# EAGLE design Raven_Programmer (EAGLE 9.6.2)
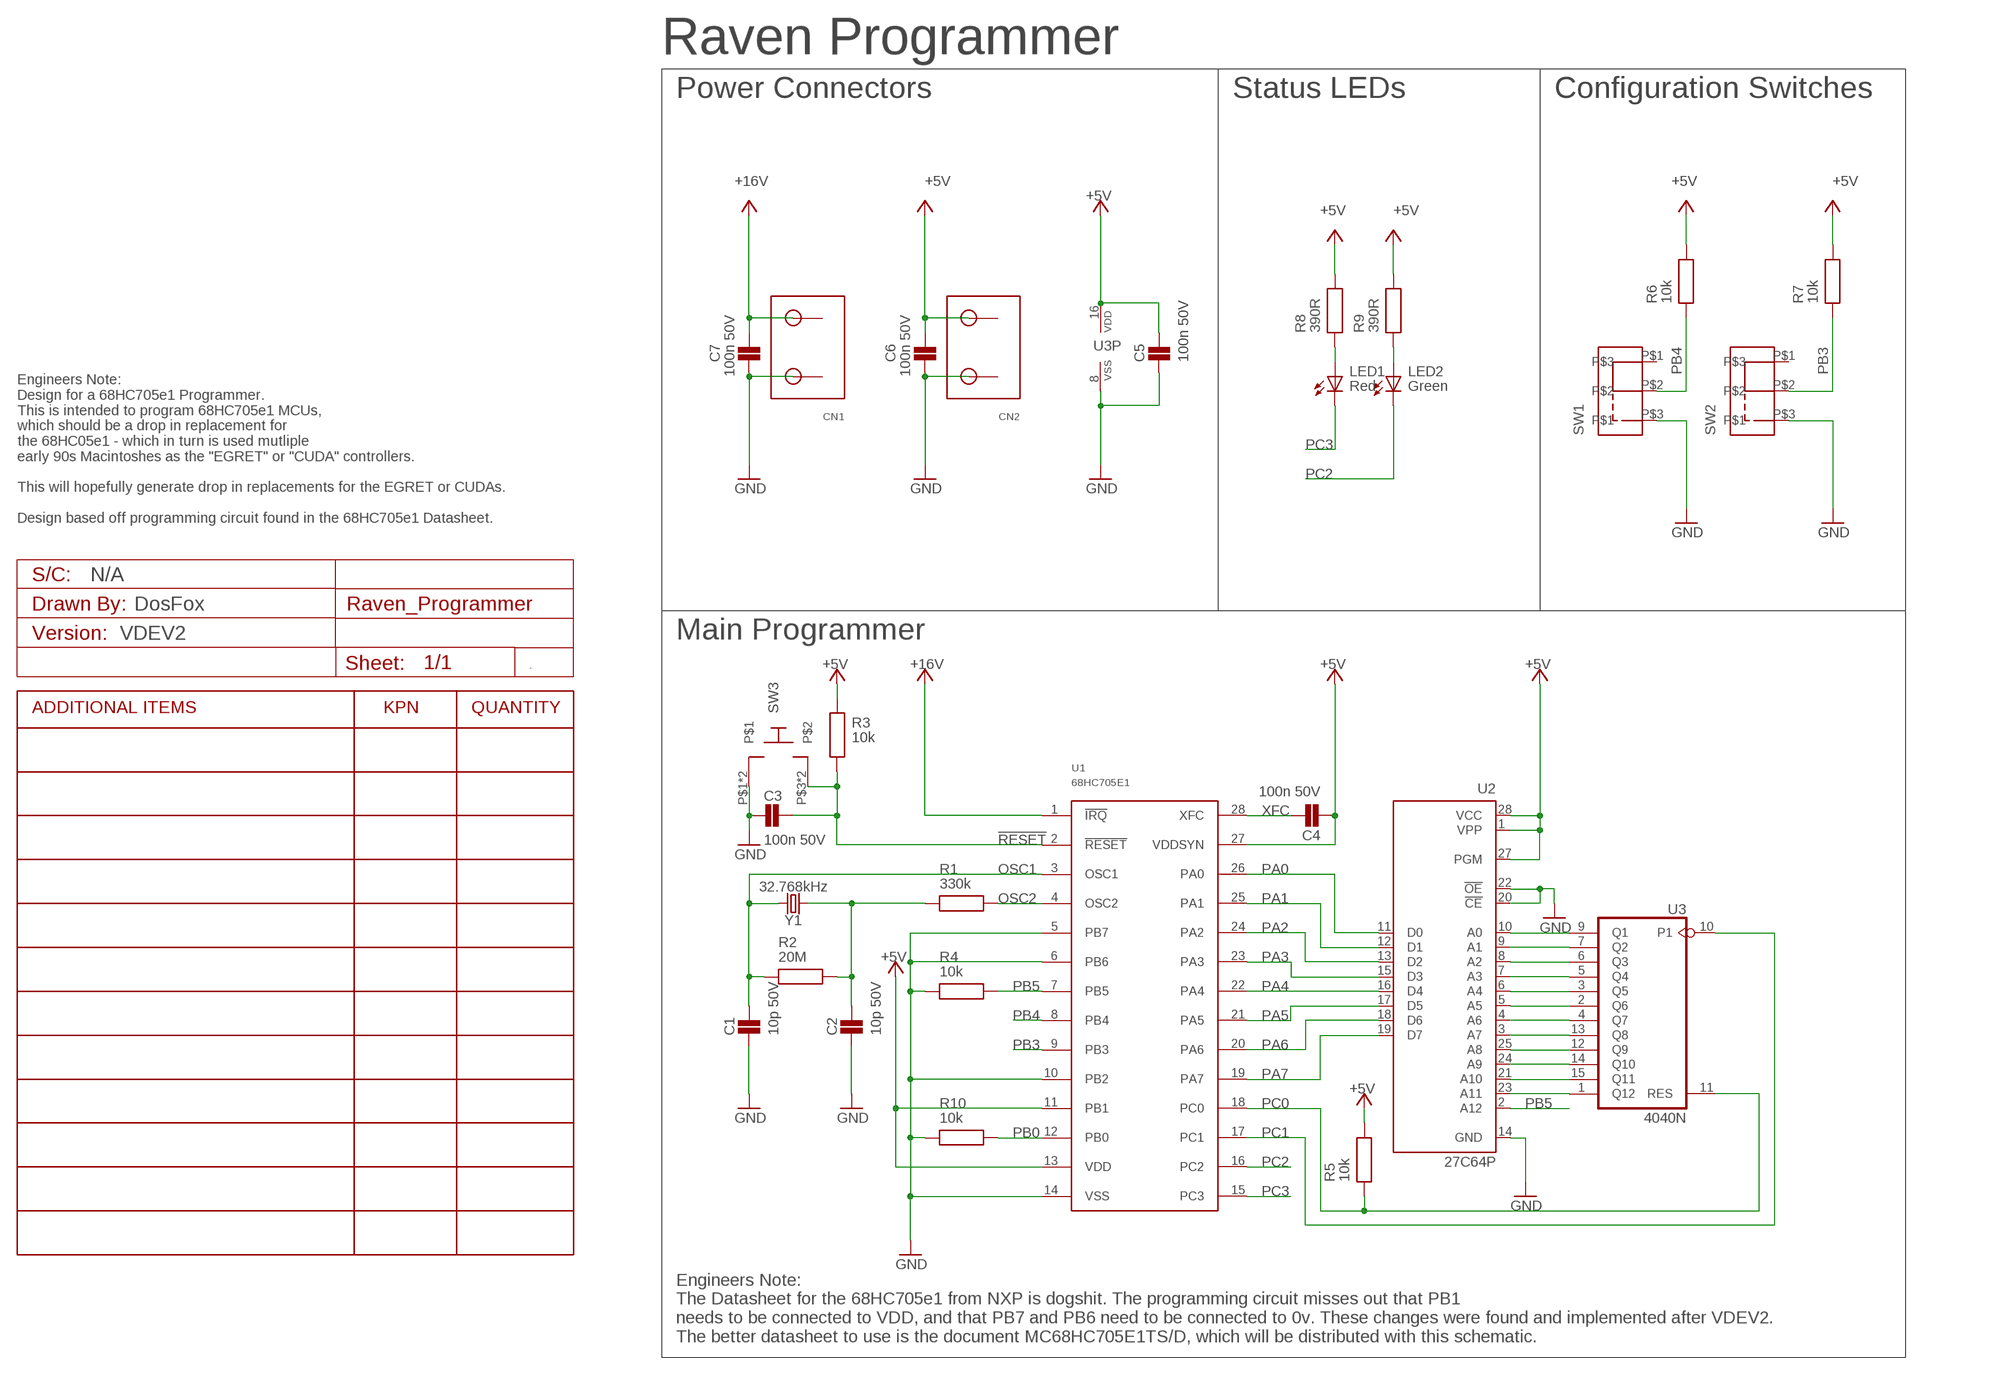
[diagram p0: schematic, sheet 1]

## Parts
A1  VDEV2  PROJECT_DETAILS_CUSTOM  [PCB_CUSTOM_DETAILS]
C1  10p 50V  1N_TH_CAP  [CAP_5.08MM_PITCH]
C2  10p 50V  1N_TH_CAP  [CAP_5.08MM_PITCH]
C3  100n 50V  100N_TH_CAP  [CAP_5.08MM_PITCH]
C4  100n 50V  100N_TH_CAP  [CAP_5.08MM_PITCH]
C5  100n 50V  100N_TH_CAP  [CAP_5.08MM_PITCH]
C6  100n 50V  100N_TH_CAP  [CAP_5.08MM_PITCH]
C7  100n 50V  100N_TH_CAP  [CAP_5.08MM_PITCH]
CN1  VTB301V-2P-B  TERMINALBLOCK2WAY  [TERMINALBLOCK2WAY]
CN2  VTB301V-2P-B  TERMINALBLOCK2WAY  [TERMINALBLOCK2WAY]
LED1  Red  5MM_LED_RED  [5MM_TH_VERT_STANDARD]
LED2  Green  5MM_LED_GREEN  [5MM_TH_VERT_STANDARD]
R1  330k  330K_TH_RESISTOR  [RESISTORTHRUHOLE]
R2  20M  10M_TH_RESISTOR  [RESISTORTHRUHOLE]
R3  10k  10K_TH_RESISTOR  [RESISTORTHRUHOLE]
R4  10k  10K_TH_RESISTOR  [RESISTORTHRUHOLE]
R5  10k  10K_TH_RESISTOR  [RESISTORTHRUHOLE]
R6  10k  10K_TH_RESISTOR  [RESISTORTHRUHOLE]
R7  10k  10K_TH_RESISTOR  [RESISTORTHRUHOLE]
R8  390R  330R_TH_RESISTOR  [RESISTORTHRUHOLE]
R9  390R  330R_TH_RESISTOR  [RESISTORTHRUHOLE]
R10  10k  10K_TH_RESISTOR  [RESISTORTHRUHOLE]
SW1  SK12D07_SLIDE_SWITCH  [SK12D07_SLIDE_SWITCH]
SW2  SK12D07_SLIDE_SWITCH  [SK12D07_SLIDE_SWITCH]
SW3  DTS-61  DIP_TACT_SWITCH_6X6TH  [DIP_DTS_6_TACT_SWITCH_6X6_TH]
U1  68HC705E1  [DIP28]
U2  27C64P  [DIL28-6]
U3  4040N  [DIL16]
Y1  32.768kHz  CRYSTAL-32.768KHZPTH-2X6  [CRYSTAL-PTH-2X6-CYL]

## Nets
!RESET: C3.P$2 R3.P$1 SW3.P$3 SW3.P$4 U1.2(!RESET)
+5V: C4.P$1 C5.P$2 C6.P$2 CN2.P$2 R3.P$2 R5.P$2 R6.P$2 R7.P$2 R8.P$2 R9.P$2 U1.11(PB1) U1.13(VDD) U1.27(VDDSYN) U2.1(VPP) U2.27(PGM) U2.28(VCC) U3.16(VDD) ; supply symbol labelled VBUS
+16V: C7.P$2 CN1.P$2 U1.1(!IRQ) ; supply symbol labelled VBUS
GND: C1.P$1 C2.P$1 C3.P$1 C5.P$1 C6.P$1 C7.P$1 CN1.P$1 CN2.P$1 R4.P$1 R10.P$1 SW1.P$3 SW2.P$3 SW3.P$1 SW3.P$2 U1.5(PB7) U1.6(PB6) U1.10(PB2) U1.14(VSS) U2.14(GND) U2.20(!CE) U2.22(!OE) U3.8(VSS)
N$1: U2.10(A0) U3.9(Q1)
N$2: U2.9(A1) U3.7(Q2)
N$3: U2.8(A2) U3.6(Q3)
N$4: U2.7(A3) U3.5(Q4)
N$5: U2.6(A4) U3.3(Q5)
N$6: U2.4(A6) U3.4(Q7)
N$7: U2.5(A5) U3.2(Q6)
N$8: U2.3(A7) U3.13(Q8)
N$9: U2.25(A8) U3.12(Q9)
N$10: U2.24(A9) U3.14(Q10)
N$11: U2.21(A10) U3.15(Q11)
N$12: U2.23(A11) U3.1(Q12)
N$30: C2.P$2 R1.P$1 R2.P$2 Y1.1
N$36: LED1.A R8.P$1
N$37: LED2.A R9.P$1
OSC1: C1.P$2 R2.P$1 U1.3(OSC1) Y1.2
OSC2: R1.P$2 U1.4(OSC2)
PA0: U1.26(PA0) U2.11(D0)
PA1: U1.25(PA1) U2.12(D1)
PA2: U1.24(PA2) U2.13(D2)
PA3: U1.23(PA3) U2.15(D3)
PA4: U1.22(PA4) U2.16(D4)
PA5: U1.21(PA5) U2.17(D5)
PA6: U1.20(PA6) U2.18(D6)
PA7: U1.19(PA7) U2.19(D7)
PB0: R10.P$2 U1.12(PB0)
PB3: R7.P$1 SW2.P$2 U1.9(PB3)
PB4: R6.P$1 SW1.P$2 U1.8(PB4)
PB5: R4.P$2 U1.7(PB5) U2.2(A12)
PC0: R5.P$1 U1.18(PC0) U3.11(RES)
PC1: U1.17(PC1) U3.10(P1)
PC2: LED2.C U1.16(PC2)
PC3: LED1.C U1.15(PC3)
XFC: C4.P$2 U1.28(XFC)
Unconnected: SW1.P$1 SW2.P$1 U2.26(NC)

## Notes on the sheet
- Raven Programmer
- Power Connectors | Status LEDs | Configuration Switches
- Engineers Note:
  Design for a 68HC705e1 Programmer. 
  This is intended to program 68HC705e1 MCUs,
  which should be a drop in replacement for 
  the 68HC05e1 - which in turn is used mutliple
  early 90s Macintoshes as the "EGRET" or "CUDA" controllers. 
  
  This will hopefully generate drop in replacements for the EGRET or CUDAs.
  
  Design based off programming circuit found in the 68HC705e1 Datasheet.
- N/A
- DosFox
- Main Programmer
- Engineers Note:
  The Datasheet for the 68HC705e1 from NXP is dogshit. The programming circuit misses out that PB1
  needs to be connected to VDD, and that PB7 and PB6 need to be connected to 0v. These changes were found and implemented after VDEV2. 
  The better datasheet to use is the document MC68HC705E1TS/D, which will be distributed with this schematic.

## Library data of the parts
A1 = Schematic Symbols:PROJECT_DETAILS; VALUE: VDEV1
C1 C2 = Capacitors TH:1N_TH_CAP; COMPONENT: Capacitor; COST: =(INDIRECT(ADDRESS(ROW(),1)))*(INDIRECT(ADDRESS(ROW(),13))); EA: =VLOOKUP(INDIRECT(ADDRESS(ROW(),7)),[ProductCosts.xlsx]StockCosts!$A:$B,2,FALSE); KPN: 3101-1N; PACKAGE: 5.08mm PITCH; PROCESS: TH; VALUE: 1n 50V
C3-C7 = Capacitors TH:100N_TH_CAP; COMPONENT: Capacitor; COST: =(INDIRECT(ADDRESS(ROW(),1)))*(INDIRECT(ADDRESS(ROW(),13))); EA: =VLOOKUP(INDIRECT(ADDRESS(ROW(),7)),[ProductCosts.xlsx]StockCosts!$A:$B,2,FALSE); KPN: 3101-100N; PACKAGE: 5.08mm PITCH; PROCESS: TH
CN1 CN2 = Connectors:TERMINALBLOCK2WAY; COMPONENT: 2W Terminal Block; COST: =(INDIRECT(ADDRESS(ROW(),1)))*(INDIRECT(ADDRESS(ROW(),13))); DATASHEET: https://www.toby.co.uk/uploads/publications/953.pdf; EA: =VLOOKUP(INDIRECT(ADDRESS(ROW(),7)),[ProductCosts.xlsx]StockCosts!$A:$B,2,FALSE); KPN: 4161; MANUFACTURE: Toby Electronics; PACKAGE: 5mm Pitch; PROCESS: TH
LED1 = Optoelectronics:5MM_LED_RED; COMPONENT: LED; COST: =(INDIRECT(ADDRESS(ROW(),1)))*(INDIRECT(ADDRESS(ROW(),13))); EA: =VLOOKUP(INDIRECT(ADDRESS(ROW(),7)),[ProductCosts.xlsx]StockCosts!$A:$B,2,FALSE); KPN: 3504; PACKAGE: 5mm Dia; PROCESS: TH
LED2 = Optoelectronics:5MM_LED_GREEN; COMPONENT: LED; COST: =(INDIRECT(ADDRESS(ROW(),1)))*(INDIRECT(ADDRESS(ROW(),13))); EA: =VLOOKUP(INDIRECT(ADDRESS(ROW(),7)),[ProductCosts.xlsx]StockCosts!$A:$B,2,FALSE); KPN: 3505; PACKAGE: 5mm Dia; PROCESS: TH
R1 = Resistors TH:330K_TH_RESISTOR; COMPONENT: Resistor; COST: =(INDIRECT(ADDRESS(ROW(),1)))*(INDIRECT(ADDRESS(ROW(),13))); EA: =(VLOOKUP(INDIRECT(ADDRESS(ROW(),6)),[ProductCosts.xlsx]StockCosts!$A:$B,2,FALSE))/1000; KPN: 3004-330k; PACKAGE: Axial Leaded; PROCESS: TH
R2 = Resistors TH:10M_TH_RESISTOR; COMPONENT: Resistor; COST: =(INDIRECT(ADDRESS(ROW(),1)))*(INDIRECT(ADDRESS(ROW(),13))); EA: =(VLOOKUP(INDIRECT(ADDRESS(ROW(),6)),[ProductCosts.xlsx]StockCosts!$A:$B,2,FALSE))/1000; KPN: 3004-10M; PACKAGE: Axial Leaded; PROCESS: TH; VALUE: 10M
R3-R7 R10 = Resistors TH:10K_TH_RESISTOR; COMPONENT: Resistor; COST: =(INDIRECT(ADDRESS(ROW(),1)))*(INDIRECT(ADDRESS(ROW(),13))); EA: =(VLOOKUP(INDIRECT(ADDRESS(ROW(),6)),[ProductCosts.xlsx]StockCosts!$A:$B,2,FALSE))/1000; KPN: 3004-10k; PACKAGE: Axial Leaded; PROCESS: TH
R8 R9 = Resistors TH:330R_TH_RESISTOR; COMPONENT: Resistor; COST: =(INDIRECT(ADDRESS(ROW(),1)))*(INDIRECT(ADDRESS(ROW(),13))); EA: =(VLOOKUP(INDIRECT(ADDRESS(ROW(),6)),[ProductCosts.xlsx]StockCosts!$A:$B,2,FALSE))/1000; KPN: 3004-330R; PACKAGE: Axial Leaded; PROCESS: TH; VALUE: 330R
SW1 SW2 = Switches:SK12D07_SLIDE_SWITCH
SW3 = Switches:DIP_TACT_SWITCH_6X6; COMPONENT: Switch; COST: =(INDIRECT(ADDRESS(ROW(),1)))*(INDIRECT(ADDRESS(ROW(),13))); DATASHEET: https://www.kitronik.co.uk/pdf/tact_switch_6mm.pdf; EA: =VLOOKUP(INDIRECT(ADDRESS(ROW(),7)),[ProductCosts.xlsx]StockCosts!$A:$B,2,FALSE); KPN: 3420; MANUFACTURE: Diptronics; PACKAGE: 6mm x 6mm; PROCESS: TH
U1 = ICs:68HC705E1
U2 = microchip:27*64: CMOS EPROM 64 K (8 K x 8), low voltage; MF: Arrow Electronics; MPN: M27C64A-10F1; OC_FARNELL: 1094265; OC_NEWARK: 93K7339
U3 = 40xx:4040: 12-stage binary/ripple COUNTER
Y1 = SparkFun-Clocks:CRYSTAL-32.768KHZ: 32.768kHz Crystal Frequency: 32.768kHz Frequency Stability: ±20ppm Load Capacitance: 12.5pF (PTH-2X6 & SMD-3.2X1.5), 6pF (SMD-2X6) SparkFun Products: SparkFun BigTime Watch Kit <https://www.sparkfun.com/products/11734> SparkFun nRF52832 Breakout <https://www.sparkfun.com/products/13990> SparkFun Real Time Clock Module <https://www.sparkfun.com/products/12708>; PROD_ID: XTAL-10112

## Board
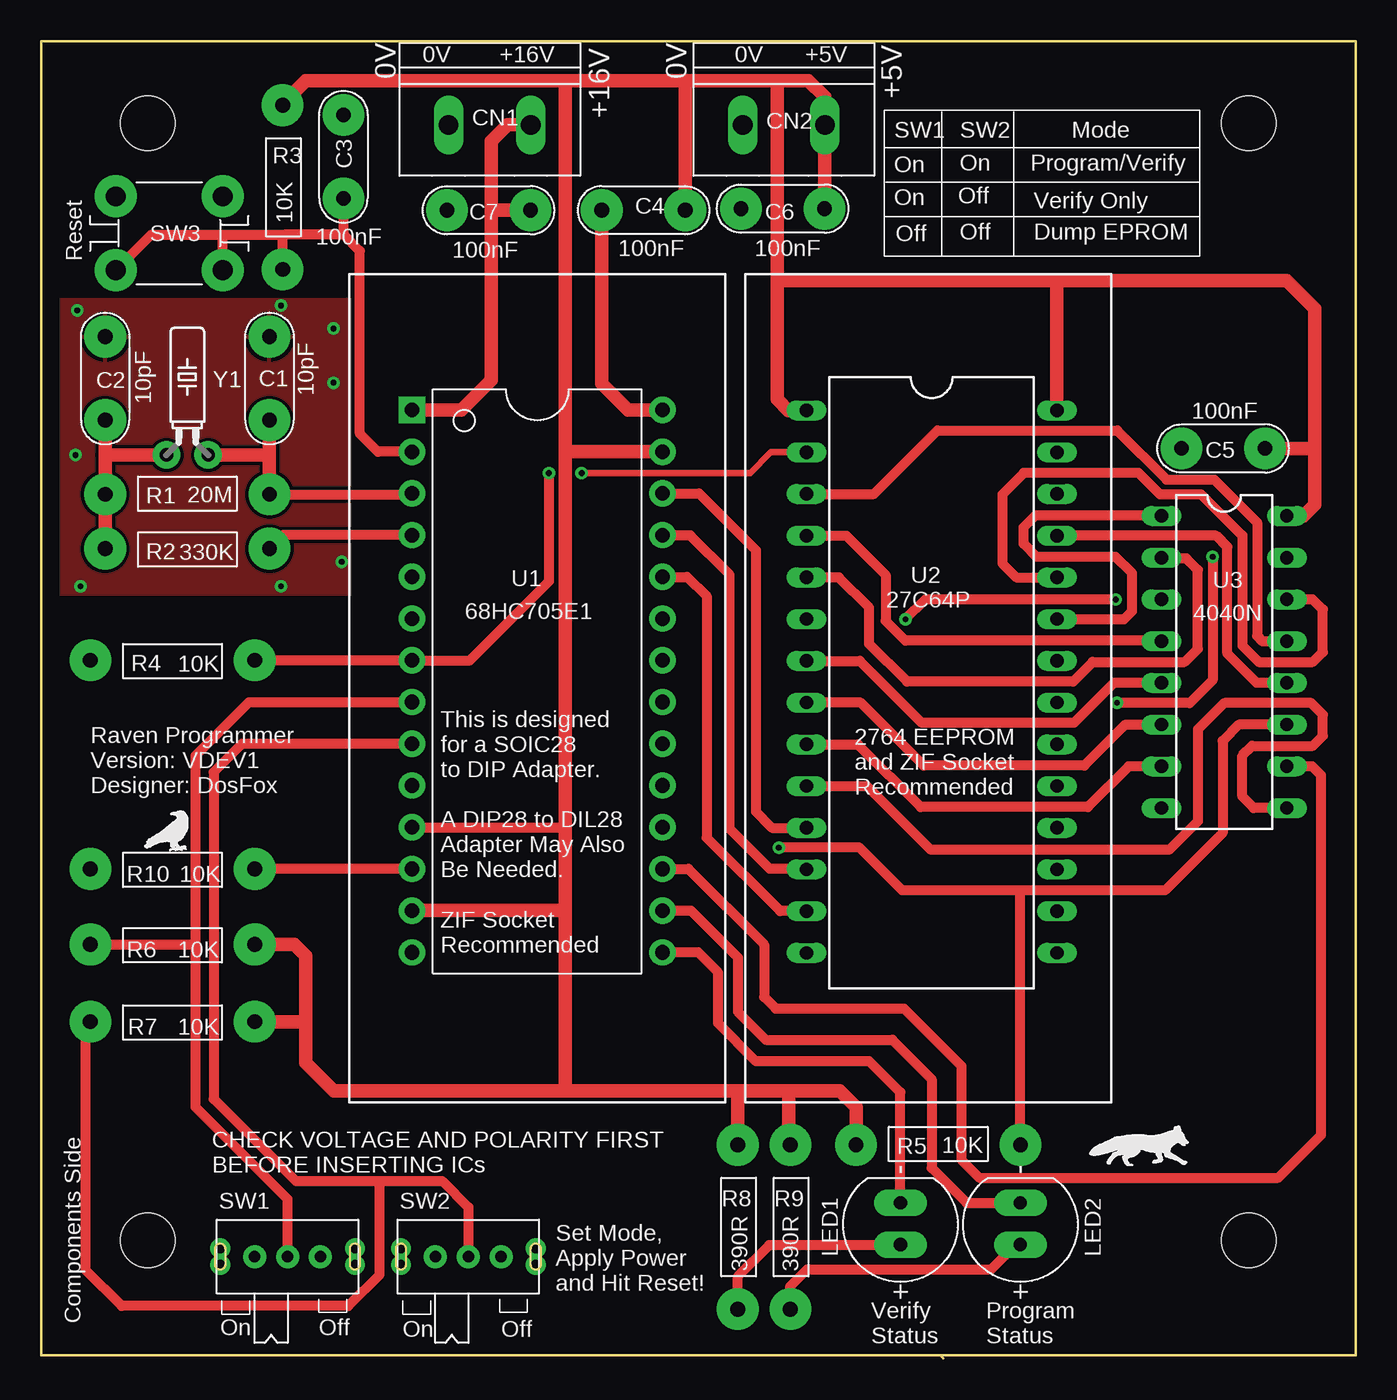
[diagram p1: board, top side]
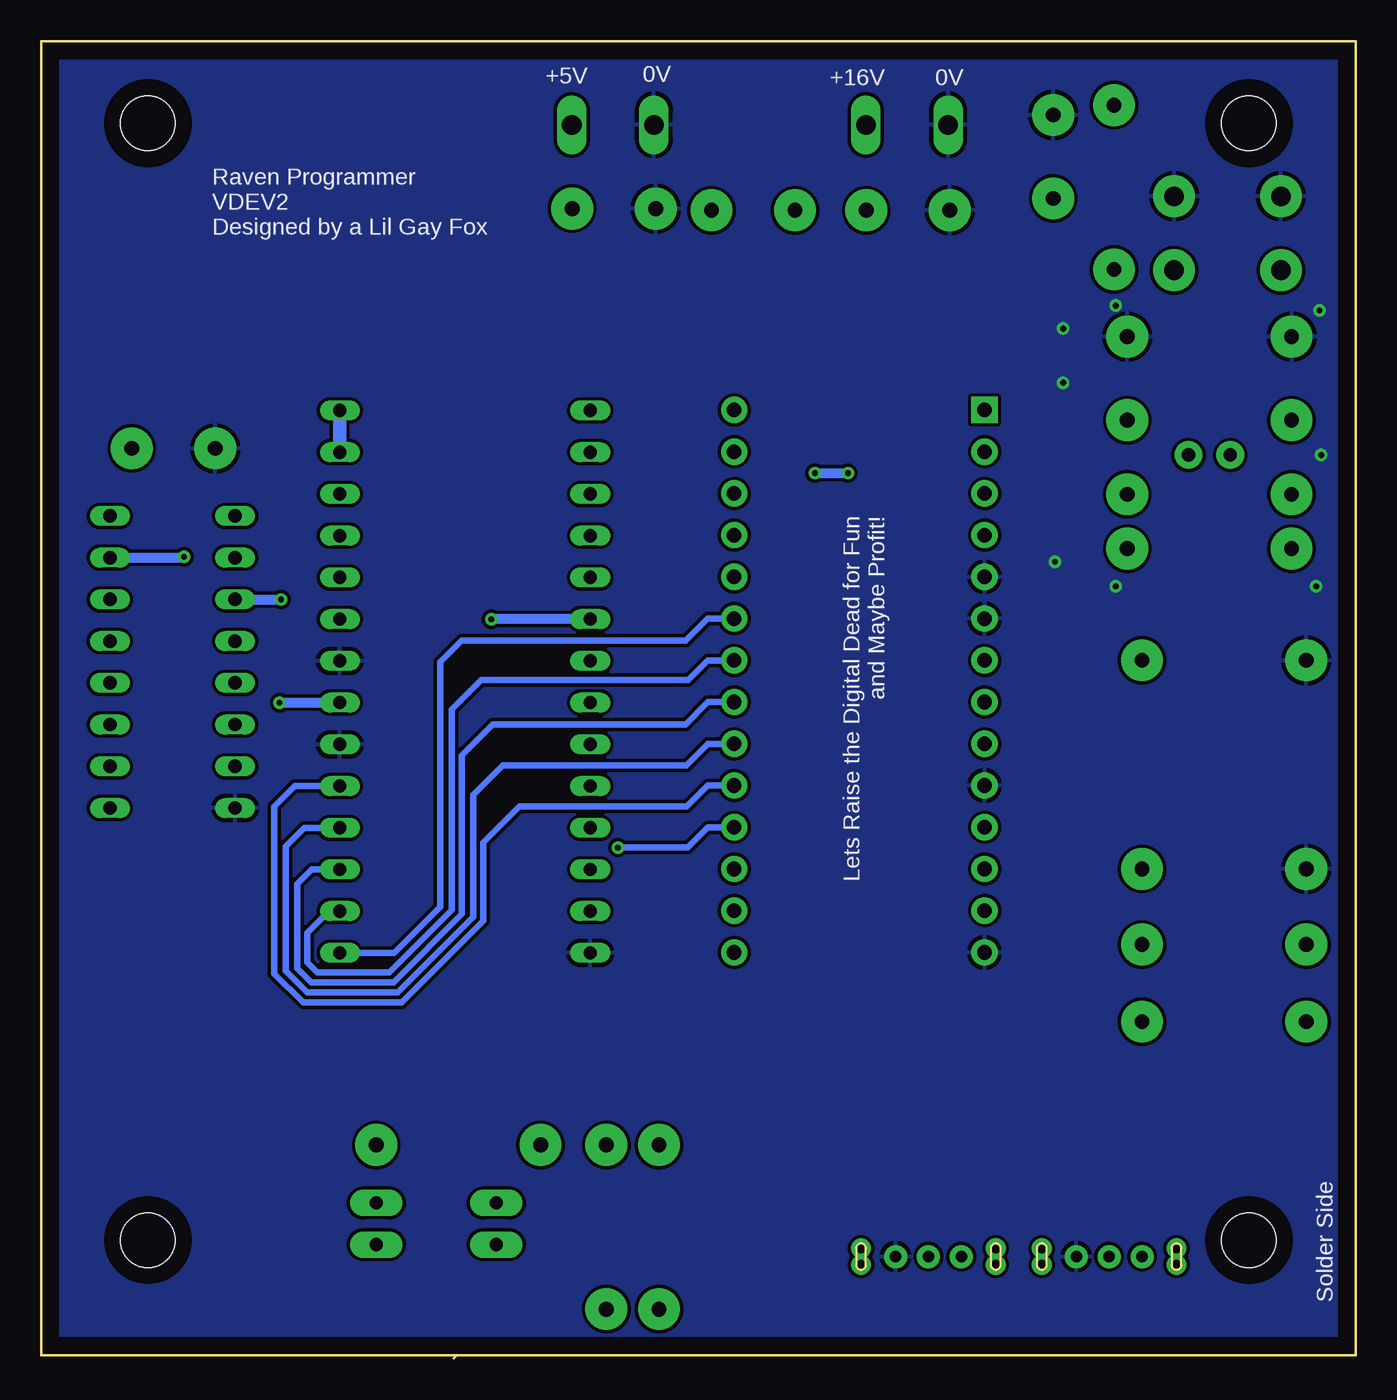
[diagram p2: board, bottom side, seen from below]

Size 80 x 80.2 mm. Coordinates in mm from the lower left corner, seen from the top.
Outline: 54.8,0.1 54.9,0
Outline: 0,0.2 80,0.2 80,80.2 0,80.2 0,0.2
Copper layers (1*16): Top 0.035mm / dielectric 1.5mm / Bottom 0.035mm
Design rules "default *": minimum track width 0.2mm, minimum drill 0.25mm, track to track 8mil, track to pad 8mil, pad to pad 8mil, via to via 8mil, smd to smd 8mil, copper to edge 40mil, drill to drill 8mil, minimum pad ring 1mil, minimum via ring 8mil, stop-mask expansion 4mil, vias tented up to drill 1mm, thermal gap 10mil
Holes 3.3 mm at 6.5,7.2 73.5,7.2 73.5,75.2 6.5,75.2
tRestrict: area 3.2,4 to 9.8,10.4; area 70.2,4 to 76.8,10.4; area 70.2,72 to 76.8,78.5; area 3.2,72 to 9.8,78.5

### Footprints (pad centres in the part's own frame; a part is rotated, then mirrored left to right if it is on the bottom)
CAP_5.08MM_PITCH = drill 0.9 pad 2.54: P$1 0,0; P$2 0,-5.08
TERMINALBLOCK2WAY = drill 1.2 pad 1.778 long: P$1 0,0; P$2 5,0
5MM_TH_VERT_STANDARD = drill 0.8 pad 1.6 long: A 0,-1.27; C 0,1.27
RESISTORTHRUHOLE = drill 0.9 pad 2.54: P$1 0,0; P$2 10,0
SK12D07_SLIDE_SWITCH = drill 0.7 pad 1.4: P$1 -2,0; P$2 0,0; P$3 2,0 | drill 0.6 pad 1.2: P$4 -4.1,0.5; P$5 -4.1,-0.5; P$6 4.1,0.5; P$7 4.1,-0.5
DIP_DTS_6_TACT_SWITCH_6X6_TH = drill 1.2 pad 2.54: P$1 -3.25,2.25; P$2 3.25,2.25; P$3 -3.25,-2.25; P$4 3.25,-2.25
DIP28 = drill 0.889 pad 1.6 square: 1 -15.24,-7.62 | drill 0.889 pad 1.6: 2 -12.7,-7.62; 3 -10.16,-7.62; 4 -7.62,-7.62; 5 -5.08,-7.62; 6 -2.54,-7.62; 7 0,-7.62; 8 2.54,-7.62; 9 5.08,-7.62; 10 7.62,-7.62; 11 10.16,-7.62; 12 12.7,-7.62; 13 15.24,-7.62; 14 17.78,-7.62; 15 17.78,7.62; 16 15.24,7.62; 17 12.7,7.62; 18 10.16,7.62; 19 7.62,7.62; 20 5.08,7.62; 21 2.54,7.62; 22 0,7.62; 23 -2.54,7.62; 24 -5.08,7.62; 25 -7.62,7.62; 26 -10.16,7.62; 27 -12.7,7.62; 28 -15.24,7.62
DIL28-6 = drill 0.813 long: 1 -16.51,-7.62; 2 -13.97,-7.62; 3 -11.43,-7.62; 4 -8.89,-7.62; 5 -6.35,-7.62; 6 -3.81,-7.62; 7 -1.27,-7.62; 8 1.27,-7.62; 9 3.81,-7.62; 10 6.35,-7.62; 11 8.89,-7.62; 12 11.43,-7.62; 13 13.97,-7.62; 14 16.51,-7.62; 15 16.51,7.62; 16 13.97,7.62; 17 11.43,7.62; 18 8.89,7.62; 19 6.35,7.62; 20 3.81,7.62; 21 1.27,7.62; 22 -1.27,7.62; 23 -3.81,7.62; 24 -6.35,7.62; 25 -8.89,7.62; 26 -11.43,7.62; 27 -13.97,7.62; 28 -16.51,7.62
DIL16 = drill 0.813 long: 1 -8.89,-3.81; 2 -6.35,-3.81; 3 -3.81,-3.81; 4 -1.27,-3.81; 5 1.27,-3.81; 6 3.81,-3.81; 7 6.35,-3.81; 8 8.89,-3.81; 9 8.89,3.81; 10 6.35,3.81; 11 3.81,3.81; 12 1.27,3.81; 13 -1.27,3.81; 14 -3.81,3.81; 15 -6.35,3.81; 16 -8.89,3.81
CRYSTAL-PTH-2X6-CYL = drill 0.813 pad 1.676: 1 -1.27,0; 2 1.27,0

### Placement (x,y rotation side)
A1  86.95,11.47 0 top  (outside the outline)
C1  13.9,62.2 0 top
C2  3.9,62.2 0 top
C3  18.4,75.7 0 top
C4  39.2,69.9 270 top
C5  69.4,55.4 90 top
C6  42.6,70 90 top
C7  24.7,69.9 90 top
CN1  24.8,75.1 0 top
CN2  42.7,75.1 0 top
LED1  52.3,8.2 0 top
LED2  59.6,8.2 0 top
R1  3.9,49.3 0 top
R2  13.9,52.6 180 top
R3  14.7,66.3 90 top
R4  3,42.5 0 top
R5  59.6,13 180 top
R6  3,25.2 0 top
R7  3,20.5 0 top
R8  42.4,3 90 top
R9  45.6,3 90 top
R10  3,29.8 0 top
SW1  15,6.2 0 top
SW2  26,6.2 0 top
SW3  7.8,68.5 0 top
U1  30.2,42.5 270 top
U2  54.2,41.2 270 top
U3  72,42.4 270 top
Y1  8.9,55 0 top

### Tracks (layer width: path | path; a pad name or v marks a point on that pad's centre or on a via)
!RESET
  Top 0.61: U1.2 20.5,55.2 19.4,56.3 19.4,67.42 18.42,68.4 | SW3.P$3 6.7,68.4 11.2,68.4 | 11.2,68.4 14.8,68.4 | SW3.P$4 11.05,68.25 11.2,68.4 | 18.42,68.4 14.8,68.4 | 14.8,68.4 14.7,68.3 R3.P$1 | C3.P$2 18.4,68.42 18.42,68.4
+5V
  Top 0.61: U1.11 31.84,32.34 31.9,32.4
  Top 0.813: R3.P$2 14.6,76.3 16.1,77.8 31.9,77.8 | 39.3,77.8 31.9,77.8 | 39.3,77.8 44.8,77.8 | U3.16 76.81,51.29 77.5,51.98 77.5,55.4 | 77.5,55.4 77.5,63.9 75.8,65.6 61.6,65.6 | C5.P$2 77.5,55.4 | C6.P$2 47.7,70 CN2.P$2 47.7,76.8 46.7,77.8 44.8,77.8 | 31.9,16.3 17.8,16.3 16.1,18 16.1,20.5 | R6.P$2 15.4,25.2 16.1,24.5 16.1,20.5 | 31.9,55.2 31.9,77.8 | 31.9,16.3 42.4,16.3 | 42.4,16.3 45.5,16.3 | 45.5,16.3 48.6,16.3 49.6,15.3 R5.P$2 | R9.P$2 45.5,13.1 45.5,16.3 | R8.P$2 42.4,16.3 | C4.P$1 39.2,77.7 39.3,77.8 | 31.9,55.2 31.9,32.4 31.9,27.3 | 31.9,27.3 31.9,16.3 | U1.27 31.9,55.2 | U2.1 45.48,57.71 44.8,58.39 44.8,65.6 | 44.8,65.6 44.8,77.8 | 44.8,65.6 61.6,65.6 | U2.28 61.82,65.38 61.6,65.6 | R7.P$2 16.1,20.5 | U1.13 31.86,27.26 31.9,27.3
  Bottom 0.813: U2.27 U2.28
+16V
  Top 0.813: CN1.P$2 28.4,75.1 27.4,74.1 27.4,70 | U1.1 25.58,57.74 27.4,59.56 27.4,70 | C7.P$2 27.5,69.9 27.4,70
GND  (via drill 0.35)
  other vias: 2.2,63.8 14.6,64.1 14.6,47 2.4,47 2.1,55 17.8,62.7 18.3,48.5 17.8,59.4
  pour Bottom: 0,80.2 0,0.2 80,0.2 80,80.2
  pour Top: 0,64.5 0,46.5 18.8,46.5 18.8,64.5
N$1
  Top 0.61: U3.9 73.79,33.51 73.1,34.2 73.1,36.7 73.7,37.3 77.4,37.3 78,37.9 78,39.2 77.3,39.9 72,39.9 70.4,38.3 70.4,32.7 68.7,31 54.1,31 50.25,34.85 U2.10
N$2
  Top 0.61: U2.9 49.71,37.39 53.53,33.57 63.71,33.57 66.19,36.05 U3.7
N$3
  Top 0.61: U3.6 65.99,38.59 63.49,36.09 53.71,36.09 49.87,39.93 U2.8
N$4
  Top 0.61: U2.7 49.83,42.47 53.6,38.7 62.86,38.7 65.29,41.13 U3.5
N$5  (via drill 0.35)
  Top 0.61: v65.4,46.2 53.8,46.2 v52.6,45
  Bottom 0.406: v52.59,45.01 v52.6,45
  Bottom 0.61: U2.6 v52.59,45.01 | U3.3 v65.41,46.21 v65.4,46.2
N$6
  Top 0.406: 67.93,43.67 67.9,43.7
  Top 0.61: U3.4 67.93,43.67 | 67.9,43.7 52.6,43.7 51.4,44.9 51.4,47.7 49.01,50.09 U2.4
N$7
  Top 0.406: 68.24,48.7 U3.2
  Top 0.61: 68.24,48.7 69.7,48.7 70.4,48 70.4,43.2 69.6,42.4 64,42.4 62.8,41.2 52.7,41.2 50.4,43.5 50.4,45.7 48.55,47.55 U2.5
N$8
  Top 0.61: U3.13 74.33,43.67 74,44 74,50.9 71.4,53.5 68.5,53.5 65.5,56.5 54.55,56.5 50.68,52.63 U2.3
N$9
  Top 0.61: U3.12 73.97,41.13 72.2,42.9 72.2,49.4 71.51,50.09 U2.25
N$10
  Top 0.61: U3.14 77.39,46.21 78,45.6 78,43 77.4,42.4 74.1,42.4 73.1,43.4 73.1,50.1 70.6,52.6 68.1,52.6 66.8,53.9 59.8,53.9 58.5,52.6 58.5,48.4 59.35,47.55 U2.24
N$11  (via drill 0.35)
  Top 0.61: v65.48,39.92 65.5,39.9 69.9,39.9 71.3,41.3 v71.3,48.8
  Bottom 0.61: U2.21 v65.47,39.93 v65.48,39.92 | U3.15 71.35,48.75 v71.3,48.8
N$12
  Top 0.61: U3.1 68.17,51.31 60.51,51.31 59.8,50.6 59.8,49.6 60.6,48.8 65.4,48.8 66.4,47.8 66.4,45.5 65.91,45.01 U2.23
N$30
  Top 0.61: R2.P$2 R1.P$1
  Top 0.813: C2.P$2 3.9,55 | 3.9,55 R1.P$1 | Y1.1 3.9,55
N$36
  Top 0.61: LED1.A 52.27,6.9 44.3,6.9 42.4,5 R8.P$1
N$37
  Top 0.61: R9.P$1 45.6,4.4 46.6,5.4 57.8,5.4 59.33,6.93 LED2.A
OSC1
  Top 0.61: R2.P$1 22.52,52.6 U1.3
  Top 0.813: C1.P$2 13.9,54.9 | 13.9,54.9 R2.P$1 | Y1.2 13.8,55 13.9,54.9
OSC2
  Top 0.61: U1.4 14.68,50.12 13.9,49.34 R1.P$2
PA0
  Top 0.61: U1.26 40.04,52.66 43.5,49.2 43.5,33.29 44.48,32.31 U2.11
PA1
  Top 0.61: U2.12 46.54,29.81 44.33,29.81 41.9,32.25 41.9,47.72 39.52,50.1 37.84,50.1 U1.25
PA2
  Top 0.61: U2.13 44.97,27.23 40.5,31.7 40.5,46.4 39.32,47.58 U1.24
PA3
  Bottom 0.406: U2.15 58.51,24.69 55.7,27.5 55.7,42.4 54.4,43.7 40.76,43.7 39.42,45.04 U1.23
PA4
  Bottom 0.406: U1.22 39.42,42.5 40.62,41.3 53.2,41.3 55,39.5 55,27.3 58.8,23.5 63.2,23.5 63.8,24.1 63.8,25.9 62.47,27.23 U2.16
PA5
  Bottom 0.406: U1.21 39.42,39.96 40.78,38.6 52.5,38.6 54.39,36.71 54.39,27.05 58.55,22.89 63.55,22.89 64.41,23.75 64.41,28.89 63.53,29.77 U2.17
PA6
  Bottom 0.406: U2.18 63.99,32.31 65.12,31.18 65.12,23.59 63.8,22.28 58.3,22.28 53.7,26.88 53.7,34.3 51.9,36.1 40.74,36.1 39.42,37.42 U1.20
PA7
  Bottom 0.406: U1.19 39.42,34.88 40.7,33.6 50.9,33.6 53.09,31.41 53.09,26.62 58.04,21.67 64.06,21.67 65.8,23.41 65.8,33.6 64.55,34.85 U2.19
PB0
  Top 0.61: U1.12 R10.P$2
PB3
  Top 0.61: U1.9 12.22,37.42 10.5,35.7 10.5,15.8 15.5,10.8 20.6,10.8 | 20.6,10.8 24.4,10.8 26,9.2 SW2.P$2 | 20.6,10.8 20.6,5.1 18.7,3.2 4.9,3.2 2.7,5.4 2.7,19.3 3.8,20.4 R7.P$1
PB4
  Top 0.61: U1.8 12.66,39.96 9.4,36.7 9.4,25.2 | SW1.P$2 15,9.7 9.4,15.3 9.4,25.2 | R6.P$1 9.4,25.2
PB5  (via drill 0.35)
  Top 0.406: U2.2 44.42,55.17 43.15,53.9 v32.9,53.9
  Top 0.61: R4.P$2 U1.7 26.1,42.5 30.9,47.3 v30.9,53.9
  Bottom 0.61: v32.9,53.9 v30.9,53.9
PC0  (via drill 0.35)
  Top 0.61: U3.11 72.89,38.59 71.9,37.6 71.9,32 68.4,28.5 59.6,28.5 | 59.6,28.5 52.4,28.5 49.8,31.1 v44.9,31.1 | R5.P$1 59.6,28.5
  Bottom 0.406: v44.9,31.1 40.66,31.1 39.42,32.34 U1.18
PC1
  Top 0.61: U1.17 39.4,29.8 44,25.2 44,22 44.7,21.3 52.5,21.3 56,17.8 56,12.1 57.1,11 75.3,11 77.9,13.6 77.9,35.5 77.35,36.05 U3.10
PC2
  Top 0.61: LED2.C 56.33,9.47 54.2,11.6 54.2,17 51.8,19.4 44.1,19.4 42.4,21.1 42.4,24.4 39.54,27.26 U1.16
PC3
  Top 0.61: U1.15 39.98,24.72 41.2,23.5 41.2,20.4 43.5,18.1 50.4,18.1 52.3,16.2 LED1.C
XFC
  Top 0.813: C4.P$2 34.12,59.34 35.72,57.74 U1.28

### Text on the board
tNames: 0V | +16V | 0V | +5V | 0V | 0V | +5V | +16V | SW1 | SW2 | Mode | On | On | Program/Verify | On | Off | Verify Only | 10K | 100nF | Off | Off | Dump EPROM | Reset | 100nF | 100nF | 100nF | 10pF | 10pF | 100nF | 20M | 330K | 10K | Raven Programmer / Version: VDEV1 / Designer: DosFox | 2764 EEPROM / and ZIF Socket / Recommended | 10K | 10K | This is designed / for a SOIC28 / to DIP Adapter. / / A DIP28 to DIL28 / Adapter May Also / Be Needed. / / ZIF Socket / Recommended | 10K | Components Side | 10K | CHECK VOLTAGE AND POLARITY FIRST / BEFORE INSERTING ICs | 390R | 390R | Set Mode, / Apply Power / and Hit Reset! | On | Off | On | Off | Verify / Status | Program / Status
bNames: 0V | 0V | +16V | +5V | Raven Programmer / VDEV2 / Designed by a Lil Gay Fox | Lets Raise the Digital Dead for Fun / and Maybe Profit! | Solder Side
tDocu: Raven Programmer | Yes | Yes | 80mm x 80mm | Yes | 2 | Yes | Yes | Yes | No | HASL (Lead Free) | Yes | Blue (Both Sides) | Yes | White (Both Sides) | Yes | Yes | Yes | No | No | No